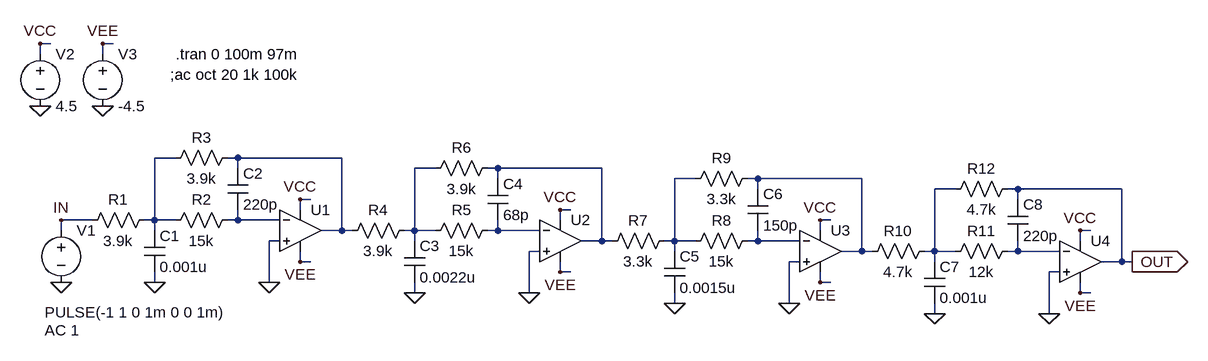
[diagram p0: schematic Nucleo_DCO_LFO_MFB_8th_Bessel_25kHz@1kHzSaw.asc]
Nucleo_DCO_LFO_MFB_8th_Bessel_25kHz@1kHzSaw.asc, the LTspice schematic file:
Version 4
SHEET 1 2020 680
WIRE 176 -240 160 -240
WIRE 272 -240 256 -240
WIRE 160 -224 160 -240
WIRE 256 -224 256 -240
WIRE 368 -64 336 -64
WIRE 464 -64 448 -64
WIRE 624 -64 464 -64
WIRE 464 -48 464 -64
WIRE 768 -48 736 -48
WIRE 864 -48 848 -48
WIRE 1024 -48 864 -48
WIRE 864 -32 864 -48
WIRE 1168 -32 1136 -32
WIRE 1264 -32 1248 -32
WIRE 1424 -32 1264 -32
WIRE 1264 -16 1264 -32
WIRE 1568 -16 1536 -16
WIRE 1664 -16 1648 -16
WIRE 1824 -16 1664 -16
WIRE 576 0 560 0
WIRE 1664 0 1664 -16
WIRE 560 16 560 0
WIRE 976 16 960 16
WIRE 240 32 192 32
WIRE 336 32 336 -64
WIRE 336 32 320 32
WIRE 368 32 336 32
WIRE 464 32 464 16
WIRE 464 32 448 32
WIRE 528 32 464 32
WIRE 960 32 960 16
WIRE 1376 32 1360 32
WIRE 192 48 192 32
WIRE 336 48 336 32
WIRE 624 48 624 -64
WIRE 624 48 592 48
WIRE 640 48 624 48
WIRE 736 48 736 -48
WIRE 736 48 720 48
WIRE 768 48 736 48
WIRE 864 48 864 32
WIRE 864 48 848 48
WIRE 928 48 864 48
WIRE 1360 48 1360 32
WIRE 1776 48 1760 48
WIRE 528 64 512 64
WIRE 736 64 736 48
WIRE 1024 64 1024 -48
WIRE 1024 64 992 64
WIRE 1040 64 1024 64
WIRE 1136 64 1136 -32
WIRE 1136 64 1120 64
WIRE 1168 64 1136 64
WIRE 1264 64 1264 48
WIRE 1264 64 1248 64
WIRE 1328 64 1264 64
WIRE 1760 64 1760 48
WIRE 928 80 912 80
WIRE 1136 80 1136 64
WIRE 1424 80 1424 -32
WIRE 1424 80 1392 80
WIRE 1440 80 1424 80
WIRE 1536 80 1536 -16
WIRE 1536 80 1520 80
WIRE 1568 80 1536 80
WIRE 1664 80 1664 64
WIRE 1664 80 1648 80
WIRE 1728 80 1664 80
WIRE 560 96 560 80
WIRE 576 96 560 96
WIRE 1328 96 1312 96
WIRE 1536 96 1536 80
WIRE 1824 96 1824 -16
WIRE 1824 96 1792 96
WIRE 1840 96 1824 96
WIRE 960 112 960 96
WIRE 976 112 960 112
WIRE 1728 112 1712 112
WIRE 336 128 336 112
WIRE 512 128 512 64
WIRE 1360 128 1360 112
WIRE 1376 128 1360 128
WIRE 736 144 736 128
WIRE 912 144 912 80
WIRE 1760 144 1760 128
WIRE 1776 144 1760 144
WIRE 1136 160 1136 144
WIRE 1312 160 1312 96
WIRE 1536 176 1536 160
WIRE 1712 176 1712 112
FLAG 336 128 0
FLAG 512 128 0
FLAG 560 0 VCC
FLAG 560 96 VEE
FLAG 736 144 0
FLAG 912 144 0
FLAG 960 16 VCC
FLAG 960 112 VEE
FLAG 192 128 0
FLAG 160 -144 0
FLAG 256 -144 0
FLAG 160 -240 VCC
FLAG 256 -240 VEE
FLAG 192 32 IN
FLAG 1136 160 0
FLAG 1312 160 0
FLAG 1360 32 VCC
FLAG 1360 128 VEE
FLAG 1536 176 0
FLAG 1712 176 0
FLAG 1760 48 VCC
FLAG 1760 144 VEE
FLAG 1840 96 OUT
IOPIN 1840 96 Out
SYMBOL voltage 192 32 R0
WINDOW 3 -25 142 Left 2
WINDOW 123 -25 170 Left 2
WINDOW 39 0 0 Left 2
SYMATTR Value PULSE(-1 1 0 1m 0 0 1m)
SYMATTR Value2 AC 1
SYMATTR InstName V1
SYMBOL res 336 16 R90
WINDOW 0 0 56 VBottom 2
WINDOW 3 32 56 VTop 2
SYMATTR InstName R1
SYMATTR Value 3.9k
SYMBOL res 464 16 R90
WINDOW 0 0 56 VBottom 2
WINDOW 3 32 56 VTop 2
SYMATTR InstName R2
SYMATTR Value 15k
SYMBOL res 464 -80 R90
WINDOW 0 0 56 VBottom 2
WINDOW 3 32 56 VTop 2
SYMATTR InstName R3
SYMATTR Value 3.9k
SYMBOL cap 320 48 R0
SYMATTR InstName C1
SYMATTR Value 0.001u
SYMBOL cap 448 -48 R0
SYMATTR InstName C2
SYMATTR Value 220p
SYMBOL Opamps\\UniversalOpamp2 560 48 R0
SYMATTR InstName U1
SYMBOL res 736 32 R90
WINDOW 0 0 56 VBottom 2
WINDOW 3 32 56 VTop 2
SYMATTR InstName R4
SYMATTR Value 3.9k
SYMBOL res 864 32 R90
WINDOW 0 0 56 VBottom 2
WINDOW 3 32 56 VTop 2
SYMATTR InstName R5
SYMATTR Value 15k
SYMBOL res 864 -64 R90
WINDOW 0 0 56 VBottom 2
WINDOW 3 32 56 VTop 2
SYMATTR InstName R6
SYMATTR Value 3.9k
SYMBOL cap 720 64 R0
SYMATTR InstName C3
SYMATTR Value 0.0022u
SYMBOL cap 848 -32 R0
SYMATTR InstName C4
SYMATTR Value 68p
SYMBOL Opamps\\UniversalOpamp2 960 64 R0
SYMATTR InstName U2
SYMBOL voltage 160 -240 R0
WINDOW 123 0 0 Left 2
WINDOW 39 0 0 Left 2
SYMATTR InstName V2
SYMATTR Value 4.5
SYMBOL voltage 256 -240 R0
WINDOW 123 0 0 Left 2
WINDOW 39 0 0 Left 2
SYMATTR InstName V3
SYMATTR Value -4.5
SYMBOL res 1136 48 R90
WINDOW 0 0 56 VBottom 2
WINDOW 3 32 56 VTop 2
SYMATTR InstName R7
SYMATTR Value 3.3k
SYMBOL res 1264 48 R90
WINDOW 0 0 56 VBottom 2
WINDOW 3 32 56 VTop 2
SYMATTR InstName R8
SYMATTR Value 15k
SYMBOL res 1264 -48 R90
WINDOW 0 0 56 VBottom 2
WINDOW 3 32 56 VTop 2
SYMATTR InstName R9
SYMATTR Value 3.3k
SYMBOL cap 1120 80 R0
SYMATTR InstName C5
SYMATTR Value 0.0015u
SYMBOL cap 1248 -16 R0
SYMATTR InstName C6
SYMATTR Value 150p
SYMBOL Opamps\\UniversalOpamp2 1360 80 R0
SYMATTR InstName U3
SYMBOL res 1536 64 R90
WINDOW 0 0 56 VBottom 2
WINDOW 3 32 56 VTop 2
SYMATTR InstName R10
SYMATTR Value 4.7k
SYMBOL res 1664 64 R90
WINDOW 0 0 56 VBottom 2
WINDOW 3 32 56 VTop 2
SYMATTR InstName R11
SYMATTR Value 12k
SYMBOL res 1664 -32 R90
WINDOW 0 0 56 VBottom 2
WINDOW 3 32 56 VTop 2
SYMATTR InstName R12
SYMATTR Value 4.7k
SYMBOL cap 1520 96 R0
SYMATTR InstName C7
SYMATTR Value 0.001u
SYMBOL cap 1648 0 R0
SYMATTR InstName C8
SYMATTR Value 220p
SYMBOL Opamps\\UniversalOpamp2 1760 96 R0
SYMATTR InstName U4
TEXT 368 -224 Left 2 !.tran 0 100m 97m
TEXT 360 -192 Left 2 !;ac oct 20 1k 100k

The netlist it stands for:
* Nucleo_DCO_LFO_MFB_8th_Bessel_25kHz@1kHzSaw.asc
V1 IN 0 PULSE(-1 1 0 1m 0 0 1m) AC 1
R1 N001 IN 3.9k
R2 N008 N001 15k
R3 N002 N001 3.9k
C1 N001 0 0.001u
C2 N002 N008 220p
XU1 0 N008 VCC VEE N002 level.2 Avol=1Meg GBW=10Meg Slew=10Meg ilimit=25m rail=0 Vos=0 phimargin=45 en=0 enk=0 in=0 ink=0 Rin=500Meg  ; pins IN+ IN- V+ V- OUT
R4 N003 N002 3.9k
R5 N009 N003 15k
R6 N004 N003 3.9k
C3 N003 0 0.0022u
C4 N004 N009 68p
XU2 0 N009 VCC VEE N004 level.2 Avol=1Meg GBW=10Meg Slew=10Meg ilimit=25m rail=0 Vos=0 phimargin=45 en=0 enk=0 in=0 ink=0 Rin=500Meg  ; pins IN+ IN- V+ V- OUT
V2 VCC 0 4.5
V3 VEE 0 -4.5
R7 N005 N004 3.3k
R8 N010 N005 15k
R9 N006 N005 3.3k
C5 N005 0 0.0015u
C6 N006 N010 150p
XU3 0 N010 VCC VEE N006 level.2 Avol=1Meg GBW=10Meg Slew=10Meg ilimit=25m rail=0 Vos=0 phimargin=45 en=0 enk=0 in=0 ink=0 Rin=500Meg  ; pins IN+ IN- V+ V- OUT
R10 N007 N006 4.7k
R11 N011 N007 12k
R12 OUT N007 4.7k
C7 N007 0 0.001u
C8 OUT N011 220p
XU4 0 N011 VCC VEE OUT level.2 Avol=1Meg GBW=10Meg Slew=10Meg ilimit=25m rail=0 Vos=0 phimargin=45 en=0 enk=0 in=0 ink=0 Rin=500Meg  ; pins IN+ IN- V+ V- OUT
.tran 0 100m 97m
;ac oct 20 1k 100k
.lib UniversalOpamps2.sub
.backanno
.end